# Altium schematic sheet MAXREFDES117.SchDoc
size A; SheetNumber: 2; SheetTotal: 8
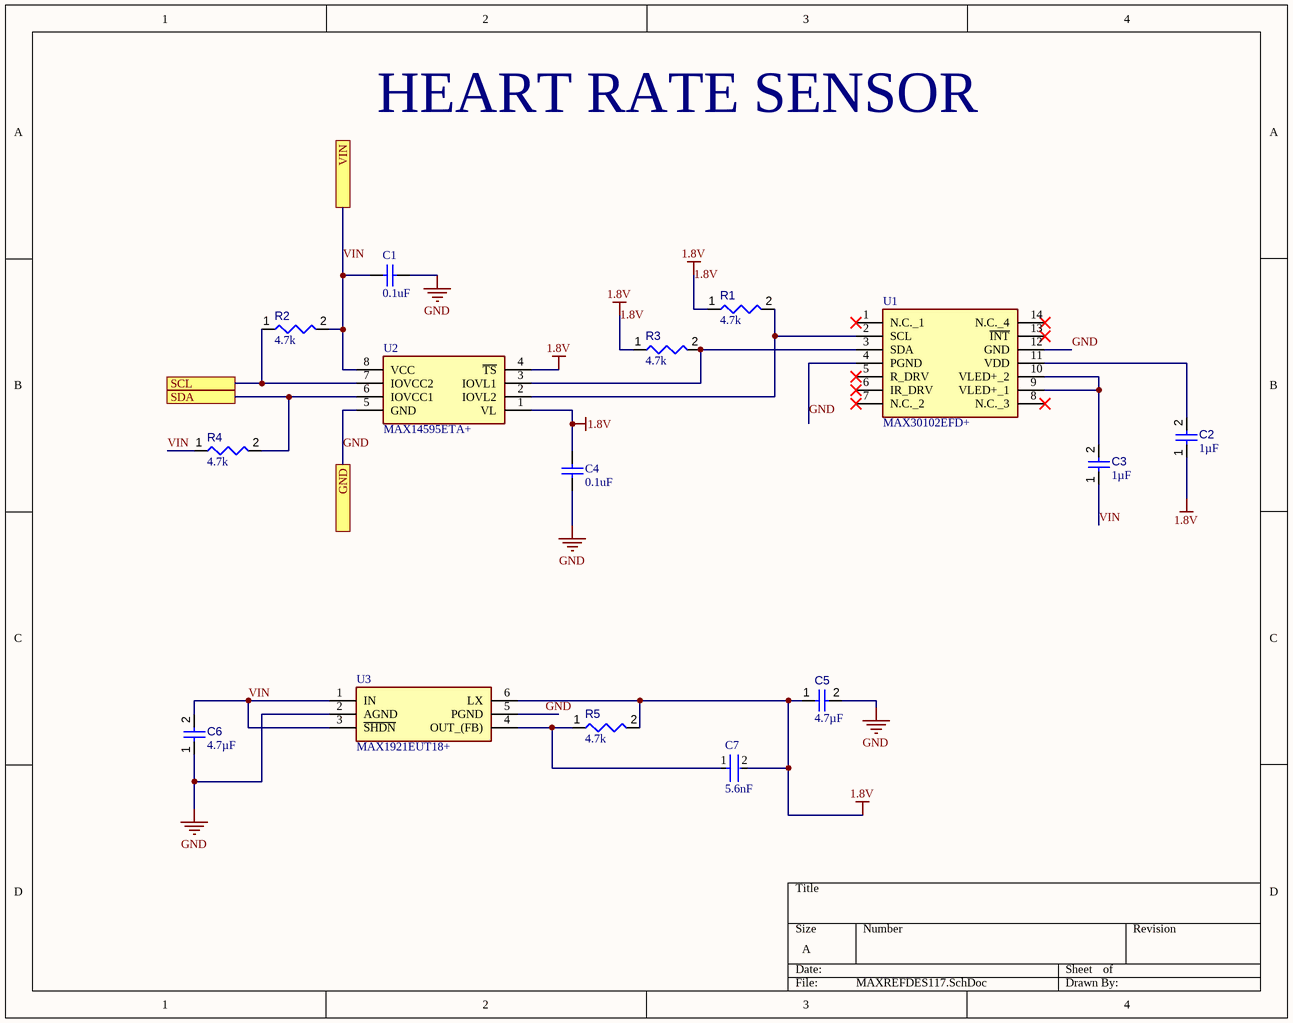
[diagram p0: MAXREFDES117.SchDoc]

## Parts
C1  0.1uF  [CAPC1608X90X35ML10T15]
C2  value 1µF  [CAPC0402(1005)60_L]  (hidden comment: Capacitor 1µF +/-20% 10V 0402)
C3  value 1µF  [CAPC0402(1005)60_L]  (hidden comment: Capacitor 1µF +/-20% 10V 0402)
C4  0.1uF  [CAPC1608X90X35ML10T15]
C5  value 4.7µF  [CAPC0603(1608)100_L]  (hidden comment: Capacitor 4.7µF +/-20% 10V 0603)
C6  value 4.7µF  [CAPC0603(1608)100_L]  (hidden comment: Capacitor 4.7µF +/-20% 10V 0603)
C7  5.6nF  [FP-C0603C-CF-MFG]
R1  value 4.7k  [RESC0402(1005)_L]  (hidden comment: 4D7KR2F)
R2  value 4.7k  [RESC0402(1005)_L]  (hidden comment: 4D7KR2F)
R3  value 4.7k  [RESC0402(1005)_L]  (hidden comment: 4D7KR2F)
R4  value 4.7k  [RESC0402(1005)_L]  (hidden comment: 4D7KR2F)
R5  value 4.7k  [RESC0402(1005)_L]  (hidden comment: 4D7KR2F)
U1  MAX30102EFD+  [14-LEAD-OESIP]
U2  MAX14595ETA+  [MAX14595ETA]
U3  MAX1921EUT18+  [SOT95P280X145-6N]

## Ports
GND (see mainsheet[4B], temp[3B]), SCL (see mainsheet[3B], ESP32-C3-MINI-1U-H4[2C], temp[2B]), SDA (see mainsheet[3B], ESP32-C3-MINI-1U-H4[2C], temp[2B]), VIN (see mainsheet[4B])

## Nets
1.8V: C2.1 C4.2 C5.1 C7.2 R1.1 R3.1 R5.2 U2.1(VL) U2.4(~{TS}) U3.6(LX)
GND: C1.1 C4.1 C5.2 C6.1 U1.4(PGND) U1.12(GND) U2.5(GND) U3.2(AGND) U3.5(PGND) ; port GND
SCL: R2.1 U2.7(IOVCC2) ; port SCL
SDA: R4.2 U2.6(IOVCC1) ; port SDA
VIN: C1.2 C3.1 C6.2 R2.2 R4.1 U2.8(VCC) U3.1(IN) U3.3(~{SHDN}) ; port VIN
NetC2_2: C2.2 U1.11(VDD)
NetC3_2: C3.2 U1.9(VLED+_1) U1.10(VLED+_2)
NetC7_1: C7.1 R5.1 U3.4(OUT_(FB))
NetR1_2: R1.2 U1.2(SCL) U2.2(IOVL2)
NetR3_2: R3.2 U1.3(SDA) U2.3(IOVL1)

Not connected (* = marked no-connect by the designer): U1 1(N.C._1)* 5(R_DRV)* 6(IR_DRV)* 7(N.C._2)* 8(N.C._3)* 13(~{INT})* 14(N.C._4)*

## Notes on the sheet
- HEART RATE SENSOR

## Library data of the parts
C1 C4 = CMP-2100-03643-1: Chip Capacitor, 0.1 uF, +/- 10%, 50 V, -55 to 125 degC, 0603 (1608 Metric), RoHS, Tape and Reel; Manufacturer: Murata; Dielectric Material: Ceramic; Voltage Rating: 50V; Capacitance: 100nF; Dielectric: X7R; Insulation Resistance: 10GR; Case Code (Metric): 1608; Lead Free: LeadFree; Depth: 0.8mm; Number of Pins: 2; Radiation Hardening: No; Case/Package: 0603; Manufacturer URL: http://www.murata.com/; Packaging: TapeandReel; Length: 1.6mm; Contact Plating: Tin; Datasheet URL: http://psearch.en.murata.com/capacitor/product/GRM188R71H104KA93%23.pdf; Tolerance: 10%; Case Code (Imperial): 0603; Min Operating Temperature: -55degC; RoHSCompliant: true; Voltage: 50V; Termination: SMD/SMT; Mount: SurfaceMount; Material: Ceramic; Package Quantity: 1; Height: 0.8mm; Thickness: 0.035inch; REACH SVHC: NoSVHC; Max Operating Temperature: 125degC; Width: 0.8mm; Package Reference: 0603; Voltage Rating (DC): 50V; Datasheet Version: 42675.0; Package Description: 2-Pin Surface Mount Device, Body 1.6 x 0.8 mm
C2 C3 = CMP-001-00063-3: Chip Capacitor, 1µF +/-20%, 10V, 0402, Thickness 0.6 mm; Tolerance: 10%; Mounting Technology: SMT; Max Operating Temperature: 85°C; Voltage Rating: 10V; Pins: 2; Case/Package: 0402; Min Operating Temperature: -55°C
C5 C6 = CMP-001-00076-4: Chip Capacitor, 4.7µF +/-20%, 10V, 0603, Thickness 1 mm; Tolerance: 10%; Mounting Technology: SMT; Case/Package: 0603; Pins: 2; Min Operating Temperature: -55°C; Max Operating Temperature: 85°C; Voltage Rating: 10V
C7 = CMP-2006-03359-2: CAP CER 5600PF 50V NP0 0603; Manufacturer: KEMET; Manufacturer Part Number: C0603C562J5GACTU; Material: Ceramic; Value: 5,600 pF; Tolerance: 0.05; Temperature Coefficient: 30ppm/°C; Temperature Characteristic: C0G; Automotive Grade: Grade 1; Device Class L1: Passive Components; Category: Cap; Temperature Range Low: -55°C; Voltage Rating: 50 V; ComponentLink2Description: Datasheet; Height: 0.87mm; Octopart: https://octopart.com/c0603c562j5gactu-kemet-13174209; Mouser Description: Multilayer Ceramic Capacitors MLCC - SMD/SMT 50volts 5600pF 5% C0G; Device Class L3: Ceramic Capacitors; Package: C0603C-CF; Temperature Range High: +125°C; Automotive: Yes; ComponentLink2URL: https://api.kemet.com/component-edge/download/datasheet/C0603C100J5GACAUTO.pdf; RoHS: TRUE; Device Class L2: Capacitors; Digikey Description: CAP CER 5600PF 50V NP0 0603; Temperature: -55°C to +125°C; Capacitance: 5,600 pF; Lead Free: Yes
R1-R5 = CMP-009-00105-2: 4K7 0.063W 1% 0402 (1005 Metric)  SMD; Power: 63mW; Mounting Technology: SMT; Case/Package: 0402; Tolerance: 1%; Pins: 2
U1 = MAX30102EFD+: Integrated Circuit; Manufacturer_Name: Analog Devices; Datasheet Link: https://datasheets.maximintegrated.com/en/ds/MAX30102.pdf; Manufacturer_Part_Number: MAX30102EFD+; Mouser Part Number: 700-MAX30102EFD+; Mouser Price/Stock: https://www.mouser.co.uk/ProductDetail/Analog-Devices-Maxim-Integrated/MAX30102EFD%2b?qs=nVS1qgv%252BQrk9UYEvS27V%2Fg%3D%3D
U2 = MAX14595ETA+: Integrated Circuit; Manufacturer_Name: Analog Devices; Datasheet Link: https://www.mouser.it/datasheet/2/256/MAX14595-471922.pdf; Height: 0.8mm; Manufacturer_Part_Number: MAX14595ETA+; Mouser Part Number: 700-MAX14595ETA+; Mouser Price/Stock: https://www.mouser.co.uk/ProductDetail/Maxim-Integrated/MAX14595ETA%2b?qs=Or6ezLSzmEvDejm1TC8ZVA%3D%3D
U3 = MAX1921EUT18+: Integrated Circuit; Manufacturer_Name: Analog Devices; Datasheet Link: https://datasheet.datasheetarchive.com/originals/distributors/SFDatasheet-4/sf-00087114.pdf; Height: 1.45mm; Manufacturer_Part_Number: MAX1921EUT18+